# Altium schematic sheet RF Sheet.SchDoc
size 297 x 209 mm
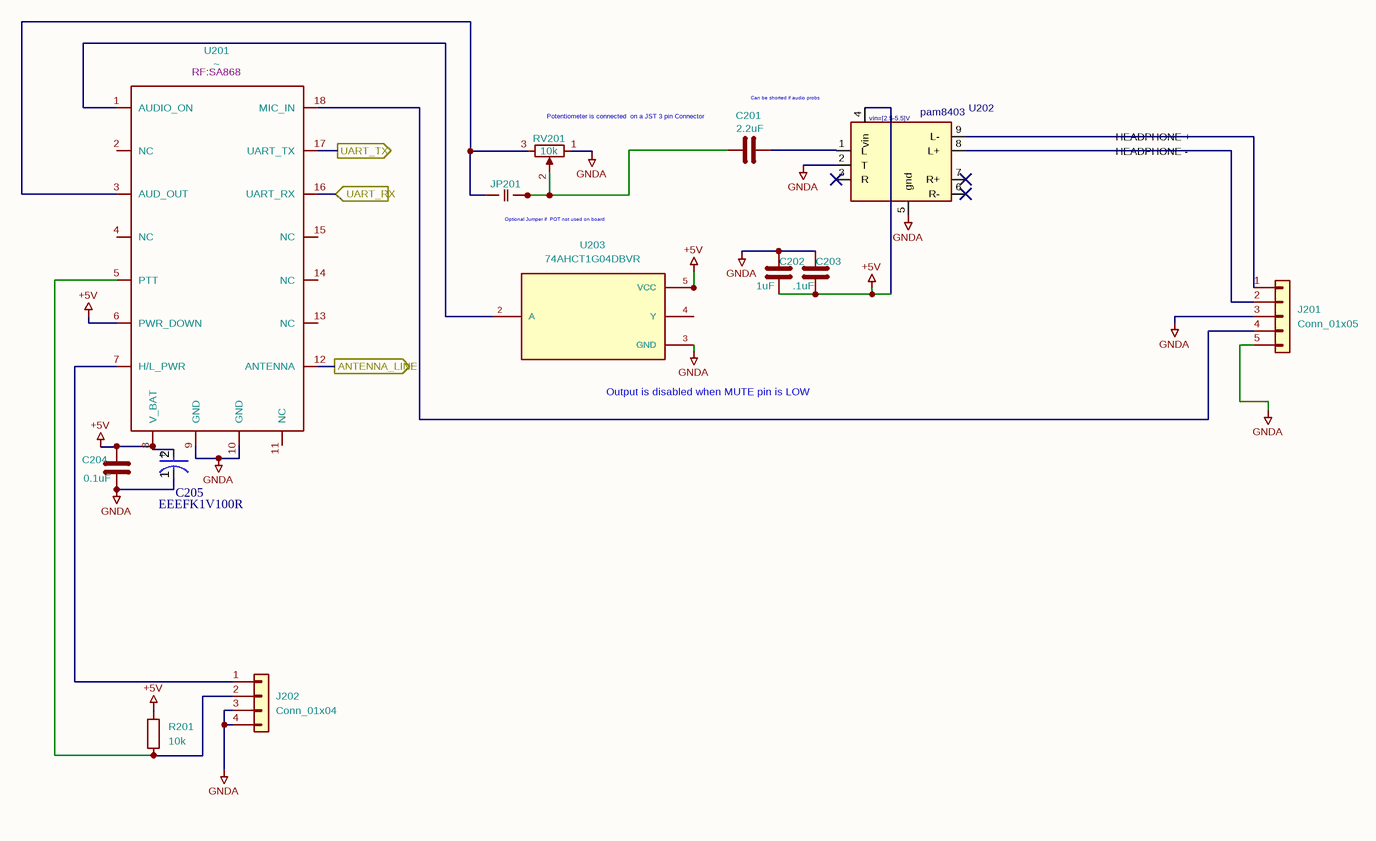
[diagram p0: RF Sheet.SchDoc]

## Parts
C201  2.2uF  [C_0603_1608Metric_Pad1.08x0.95mm_HandSolder]
C202  1uF  [C_0603_1608Metric_Pad1.08x0.95mm_HandSolder]
C203  .1uF  [C_0603_1608Metric_Pad1.08x0.95mm_HandSolder]
C204  0.1uF  [C_0603_1608Metric_Pad1.08x0.95mm_HandSolder]
C205  EEEFK1V100R  [FP-FKC-MFG]
J201  Conn_01x05  [JST_XH_B05B-XH-A_05x2.50mm_Straight]
J202  Conn_01x04  [JST_XH_B4B-XH-A_1x04_P2.50mm_Vertical]
JP201  SolderJumper_2_Open  [R_1206_3216Metric_Pad1.30x1.75mm_HandSolder]  (value not drawn)
R201  10k  [R_1206_3216Metric_Pad1.30x1.75mm_HandSolder]
RV201  10k  [JST_XH_B3B-XH-A_1x03_P2.50mm_Vertical]
U201  Footprint: RF:SA868  [SA868]  (hidden comment: ~)
U202  pam8403  [pam8403]
U203  74AHCT1G04DBVR  [SOT-23-5]

## Ports
ANTENNA_LINE (out), UART_RX (in), UART_TX (out)

## Nets
+5V: C202.2 C203.2 C204.1 C205.2(A) R201.1 U201.6(PWR_DOWN) U201.8(V_BAT) U202.4(vin) U203.5(VCC)
GNDA: C202.1 C203.1 C204.2 C205.1(C) J201.3(Pin_3) J201.5(Pin_5) J202.3(Pin_3) J202.4(Pin_4) RV201.1 U201.9(GND) U201.10(GND) U202.2(T) U202.5(gnd) U203.3(GND)
ANTENNA_LINE: U201.12(ANTENNA) ; port ANTENNA_LINE
UART_RX: U201.16(UART_RX) ; port UART_RX
UART_TX: U201.17(UART_TX) ; port UART_TX
NetC201_1: C201.1 JP201.2(B) RV201.2
NetC201_2: C201.2 U202.1(L)
NetJ201_1: J201.1(Pin_1) U202.9(L-)
NetJ201_2: J201.2(Pin_2) U202.8(L+)
NetJ201_4: J201.4(Pin_4) U201.18(MIC_IN)
NetJ202_1: J202.1(Pin_1) U201.7(H/L_PWR)
NetJ202_2: J202.2(Pin_2) R201.2 U201.5(PTT)
NetJP201_1: JP201.1(A) RV201.3 U201.3(AUD_OUT)
NetU201_1: U201.1(AUDIO_ON) U203.2(A)

Not connected (* = marked no-connect by the designer): U201 2(NC) 4(NC) 11(NC) 13(NC) 14(NC) 15(NC); U202 3(R)* 6(R-)* 7(R+)*; U203 4(Y)

## Notes on the sheet
- Potentiometer is connected
  on a JST 3 pin Connector
- Can be shorted
  if audio probs
- (near JP201) Optional Jumper if
  POT not used on board
- (near U203) Output is disabled when MUTE pin is LOW
- Labels drawn without touching a wire or pin: HEADPHONE +, HEADPHONE -
- THIS DOCUMENT AND THE DATA DISCLOSED HEREIN OR
- HEREWITH IS THE PROPERTY OF TEAM HAYA OFF ROADING AND MAY
- NOT BE FREELY DISTRIBUTED IN WHOLE. ALL RIGHTS ARE
- RESERVED AND NO EXPRESS OR IMPLIED WARANTEE IS GIVEN.
- (in symbol CMP-05427-000097-1) +
- (in symbol pam8403) vin=[2.5-5.5]V

## Library data of the parts
C201-C204 = C: Footprint: Capacitor_SMD:C_0603_1608Metric_Pad1.08x0.95mm_HandSolder
  C201: Value: 2.2uF
  C202: Value: 1uF
  C203: Value: .1uF
  C204: Value: 0.1uF
C205 = CMP-05427-000097-1: CAP ALUM 10UF 20% 35V SMD; Leakage Current: 3uA; Ripple Current: 160mA; Material: Aluminium; Impedance: 700mR; Life (Hours): 2000Hour; Radiation Hardening: No; Packaging: Tape and Reel; Construction: Cylindrical; Max Operating Temperature: 105°C; Contact Plating: Tin; Voltage Rating (DC): 35V; Series: FK; Tolerance: 20%; Voltage: 35V; RoHS Compliant: Yes; Capacitance: 10uF; Package Quantity: 1; Voltage Rating: 35V; Width: 6.5mm; ESR (Equivalent Series Resistance): 700mR; Lead Free: Lead Free; Number of Pins: 2; Height - Seated (Max): 0.228inch; Diameter: 5mm; Termination: SMD/SMT; Min Operating Temperature: -55°C; Ripple Current (AC): 160mA; Height: 5.8mm; Case/Package: Radial; Length: 5.8mm; Mount: Surface Mount
R201 = R: Value: 10k; Footprint: Resistor_SMD:R_1206_3216Metric_Pad1.30x1.75mm_HandSolder
RV201 = R_Potentiometer: Value: 10k; Footprint: Connector_JST:JST_XH_B3B-XH-A_1x03_P2.50mm_Vertical
U201 = SA868: Value: ~
U203 = 74AHCT1G04DBVR: MF: Texas Instruments; MP: SN74AHCT1G04DBVR; Value: 74AHCT1G04DBVR; Footprint: Package_TO_SOT_SMD:SOT-23-5
J201 = Conn_01x05: Value: Conn_01x05; Footprint: Connector_JST:JST_XH_B5B-XH-A_1x05_P2.50mm_Vertical
J202 = Conn_01x04: Value: Conn_01x04; Footprint: Connector_JST:JST_XH_B4B-XH-A_1x04_P2.50mm_Vertical
JP201 = SolderJumper_2_Open: Value: SolderJumper_2_Open; Footprint: Resistor_SMD:R_1206_3216Metric_Pad1.30x1.75mm_HandSolder
U202 = pam8403: Value: pam8403